# EAGLE schematic VoltageRegulation (EAGLE 8.4.3)
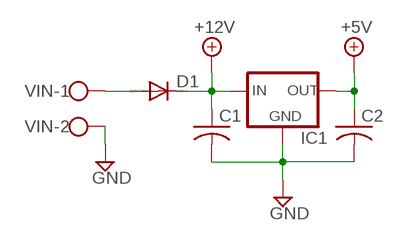
[diagram p0: schematic, sheet 1]

## Parts
C1  C-US050-055X075  [C050-055X075]
C2  C-US050-055X075  [C050-055X075]
D1  DIODE-DO07  [DO07]
IC1  78XXS  [78XXS]
VIN  W237-102  [W237-102]

## Nets
+5V: C2.1 IC1.OUT
+12V: C1.1 D1.C IC1.IN
GND: C1.2 C2.2 IC1.GND VIN.2
N$1: D1.A VIN.1

## Library data of the parts
C1 C2 = rcl:C-US: CAPACITOR, American symbol
D1 = diode:DIODE-: DIODE
IC1 = v-reg:78XXS: VOLTAGE REGULATOR
VIN = con-wago-500:W237-102: WAGO SCREW CLAMP; MPN: 237-102; OC_FARNELL: unknown; OC_NEWARK: 70K9898